# Altium schematic sheet [02] - Sheet Connector.SchDoc: =ProjectName
size A4; CheckedBy: Ven; Author: Ven; CompanyName: HUST; Revision: V.1.0
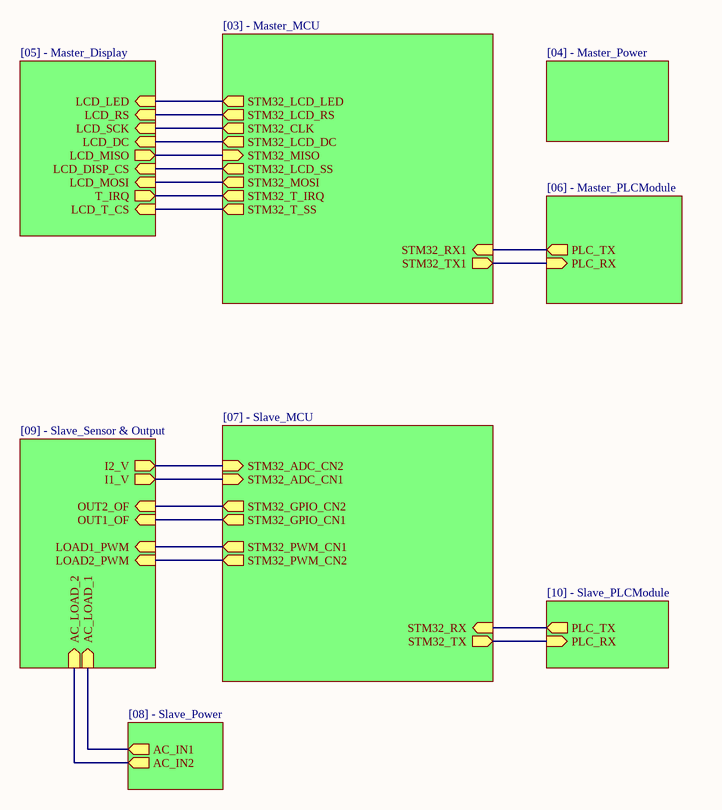
[diagram p0: [02] - Sheet Connector.SchDoc]

## Sub-sheets
1 = [03] - Master_MCU: STM32_LCD_LED (out), STM32_LCD_RS (out), STM32_CLK (out), STM32_LCD_DC (out), STM32_MISO (in), STM32_LCD_SS (out), STM32_MOSI (out), STM32_TX1 (out), STM32_T_IRQ (out), STM32_RX1 (in), STM32_T_SS (out)
2 = [04] - Master_Power: no entries
3 = [05] - Master_Display: LCD_MISO (out), T_IRQ (out), LCD_DC (in), LCD_SCK (in), LCD_LED (in), LCD_RS (in), LCD_MOSI (in), LCD_T_CS (in), LCD_DISP_CS (in)
4 = [06] - Master_PLCModule: PLC_TX (out), PLC_RX (in)
5 = [07] - Slave_MCU: STM32_ADC_CN1 (in), STM32_PWM_CN2 (out), STM32_ADC_CN2 (in), STM32_RX (in), STM32_GPIO_CN1 (out), STM32_GPIO_CN2 (out), STM32_TX (out), STM32_PWM_CN1 (out)
6 = [08] - Slave_Power: AC_IN2 (out), AC_IN1 (out)
7 = [09] - Slave_Sensor & Output: AC_LOAD_2 (in), I1_V (out), LOAD2_PWM (in), I2_V (out), AC_LOAD_1 (in), LOAD1_PWM (in), OUT2_OF (in), OUT1_OF (in)
8 = [10] - Slave_PLCModule: PLC_TX (out), PLC_RX (in)

## Nets
(unnamed): sheet 1/STM32_LCD_LED, sheet 3/LCD_LED
(unnamed): sheet 1/STM32_LCD_RS, sheet 3/LCD_RS
(unnamed): sheet 1/STM32_CLK, sheet 3/LCD_SCK
(unnamed): sheet 1/STM32_LCD_DC, sheet 3/LCD_DC
(unnamed): sheet 1/STM32_MISO, sheet 3/LCD_MISO
(unnamed): sheet 1/STM32_LCD_SS, sheet 3/LCD_DISP_CS
(unnamed): sheet 1/STM32_MOSI, sheet 3/LCD_MOSI
(unnamed): sheet 1/STM32_TX1, sheet 4/PLC_RX
(unnamed): sheet 1/STM32_T_IRQ, sheet 3/T_IRQ
(unnamed): sheet 1/STM32_RX1, sheet 4/PLC_TX
(unnamed): sheet 1/STM32_T_SS, sheet 3/LCD_T_CS
(unnamed): sheet 5/STM32_ADC_CN1, sheet 7/I1_V
(unnamed): sheet 5/STM32_PWM_CN2, sheet 7/LOAD2_PWM
(unnamed): sheet 5/STM32_ADC_CN2, sheet 7/I2_V
(unnamed): sheet 5/STM32_RX, sheet 8/PLC_TX
(unnamed): sheet 5/STM32_GPIO_CN1, sheet 7/OUT1_OF
(unnamed): sheet 5/STM32_GPIO_CN2, sheet 7/OUT2_OF
(unnamed): sheet 5/STM32_TX, sheet 8/PLC_RX
(unnamed): sheet 5/STM32_PWM_CN1, sheet 7/LOAD1_PWM
(unnamed): sheet 7/AC_LOAD_2, sheet 6/AC_IN2
(unnamed): sheet 7/AC_LOAD_1, sheet 6/AC_IN1

## Notes on the sheet
- Project:
- Page Contents:
- Size:
- Date:
- A4
- Checked by:
- Time:
- Revision:
- Sheet
- of
- File: